# EasyEDA Pro project ax08_doc.eprj, schematic frontpanel
Board Name: frontpanel; Create Date: 2025-08-28; Page Name: frontpanel; Project Name: ax08; Schematic Name: frontpanel; Update Date: 2025-08-28; Company: EasyEDA.com; Page Size: A4; Version: V1.0
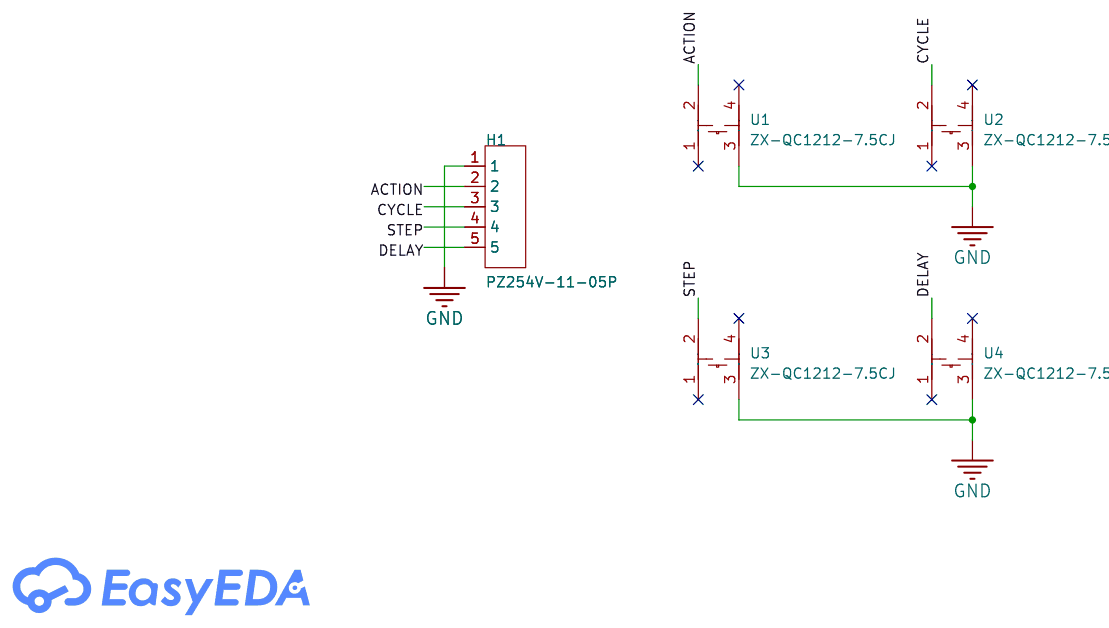
[diagram p4: schematic sheet]

## Parts
H1  PZ254V-11-05P  [HDR-TH_5P-P2.54-V-M]
U1  ZX-QC1212-7.5CJ  [KEY-TH_4P-L12.0-W12.0-P5.00-LS12.5]
U2  ZX-QC1212-7.5CJ  [KEY-TH_4P-L12.0-W12.0-P5.00-LS12.5]
U3  ZX-QC1212-7.5CJ  [KEY-TH_4P-L12.0-W12.0-P5.00-LS12.5]
U4  ZX-QC1212-7.5CJ  [KEY-TH_4P-L12.0-W12.0-P5.00-LS12.5]

## Library data of the parts
H1 = PZ254V-11-05P: LCSC Part Name: 1x5P 间距:2.54mm 方针 直插; Supplier Part: C492404; Manufacturer: XFCN(兴飞); Supplier Footprint: 插件,P=2.54mm; JLCPCB Part Class: Extended Part; Datasheet: https://atta.szlcsc.com/upload/public/pdf/source/20200309/C492404_E51533260F8710EFF5D4617281164C1D.pdf; Supplier: LCSC; Pin Structure: 1x5P; Pitch: 2.54mm; Circluar Pins/Square Pins: Policy; Mounting Type: Straight; Number of Rows: Single Row; Number of Pins: 5P; Length of Mating Pin: 6mm; Insulation Height: 2.5mm; Length of End Connection Pin: 3mm; Contact Material: Brass; Operating Temperature: -40℃~+105℃; Color: Black
U1-U4 = ZX-QC1212-7.5CJ: LCSC Part Name: 12*12*7.5插件; Supplier Part: C7470190; Manufacturer: Megastar(兆星); Supplier Footprint: DIP; JLCPCB Part Class: Extended Part; Datasheet: https://atta.szlcsc.com/upload/public/pdf/source/20230724/4B47FF3F78A9A93D44388AE7A727BAE5.pdf; Supplier: LCSC; Circuit: SPST; Actuator Style: Round Button; Operating Force: 260gf; Mounting Style: Direct Insert; Switch Length: 12mm; Switch Width: 12mm; Switch Height: 7.5mm; Strike Gundam: Without bracket; Contact Current: 50mA; Voltage Rating: 12V; Actuator/Cap Color: Black; Pin Style: PCPin; Mechanical Life: 100000 Times; Operating Temperature: -30℃~+80℃

## Nets
GND: H1.1 U1.3 U2.3 U3.3 U4.3
ACTION: H1.2 U1.2
CYCLE: H1.3 U2.2
DELAY: H1.5 U4.2
STEP: H1.4 U3.2

Not connected (* = marked no-connect by the designer): U1 1* 4*; U2 1* 4*; U3 1* 4*; U4 1* 4*
